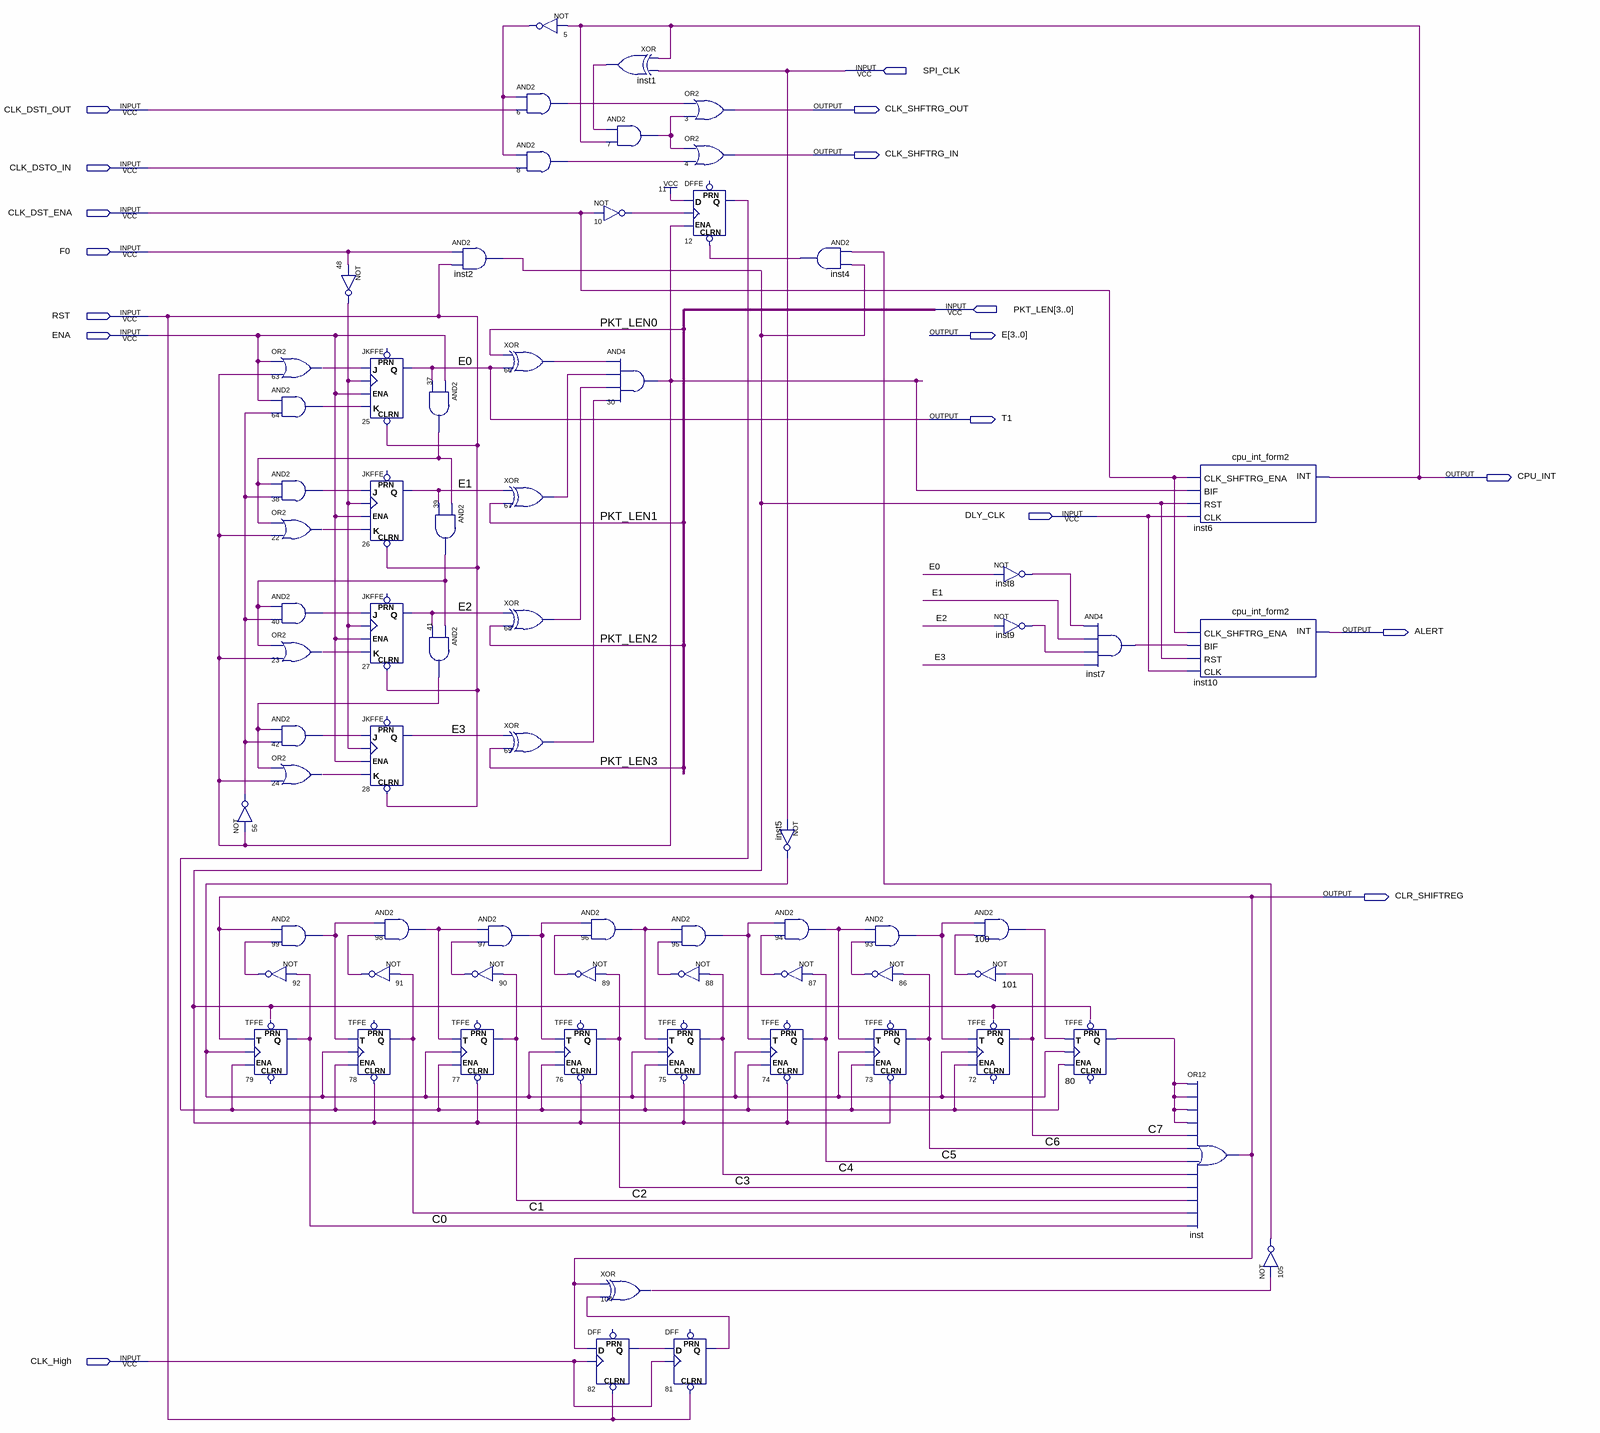
[diagram p0: schematic sheet]
// Quartus schematic stbus_ctrl2.bdf as structural Verilog: 69 symbols, 17 pins
module stbus_ctrl2 (
  input  SPI_CLK,
  input  CLK_DSTI_OUT,
  input  CLK_DSTO_IN,
  input  CLK_DST_ENA,
  input  F0,
  input  [3:0] PKT_LEN,
  input  RST,
  input  ENA,
  input  DLY_CLK,
  input  CLK_High,
  output CLK_SHFTRG_OUT,
  output CLK_SHFTRG_IN,
  output [3:0] E,
  output T1,
  output CPU_INT,
  output ALERT,
  output CLR_SHIFTREG
);

  wire C0, C1, C2, C3, C4, C5, C6, C7, inst1_out, inst2_out, inst4_out, inst5_out, inst7_out, inst8_out,
       inst9_out, n5_out, n6_out, n7_out, n8_out, n10_out, n12_q, n22_out, n23_out, n24_out, n30_out,
       n37_out, n38_out, n39_out, n40_out, n41_out, n42_out, n48_out, n56_out, n63_out, n64_out, n66_out,
       n67_out, n68_out, n69_out, n80_q, n81_q, n82_q, n86_out, n87_out, n88_out, n89_out, n90_out, n91_out,
       n92_out, n93_out, n94_out, n95_out, n96_out, n97_out, n98_out, n99_out, n100_out, n101_out, n104_out,
       n105_out;

  or u_63 (n63_out, ENA, n30_out);
  and u_64 (n64_out, ENA, n56_out);
  and u_38 (n38_out, n37_out, n56_out);
  or u_22 (n22_out, n37_out, n30_out);
  and u_40 (n40_out, n39_out, n56_out);
  or u_23 (n23_out, n39_out, n30_out);
  and u_42 (n42_out, n41_out, n56_out);
  or u_24 (n24_out, n41_out, n30_out);
  not u_56 (n56_out, n30_out);
  and u_99 (n99_out, CLR_SHIFTREG, n92_out);
  not u_92 (n92_out, C0);
  TFFE u_79 (.PRN(inst2_out), .T(CLR_SHIFTREG), .CLK(inst5_out), .ENA(n12_q), .Q(C0));  // open: CLRN
  not u_48 (n48_out, F0);
  JKFFE u_25 (.J(n63_out), .CLK(n48_out), .CLRN(RST), .K(n64_out), .ENA(ENA), .Q(E[0]));  // open: PRN
  JKFFE u_26 (.J(n38_out), .CLK(n48_out), .CLRN(RST), .K(n22_out), .ENA(ENA), .Q(E[1]));  // open: PRN
  JKFFE u_27 (.J(n40_out), .CLK(n48_out), .CLRN(RST), .K(n23_out), .ENA(ENA), .Q(E[2]));  // open: PRN
  JKFFE u_28 (.J(n42_out), .CLK(n48_out), .CLRN(RST), .K(n24_out), .ENA(ENA), .Q(E[3]));  // open: PRN
  and u_98 (n98_out, n99_out, n91_out);
  not u_91 (n91_out, C1);
  TFFE u_78 (.CLRN(inst2_out), .T(n99_out), .CLK(inst5_out), .ENA(n12_q), .Q(C1));  // open: PRN
  and u_37 (n37_out, ENA, E[0]);
  and u_39 (n39_out, n37_out, E[1]);
  and u_41 (n41_out, n39_out, E[2]);
  and inst2 (inst2_out, F0, RST);
  and u_97 (n97_out, n98_out, n90_out);
  not u_90 (n90_out, C2);
  TFFE u_77 (.CLRN(inst2_out), .T(n98_out), .CLK(inst5_out), .ENA(n12_q), .Q(C2));  // open: PRN
  not u_5 (n5_out, CPU_INT);
  and u_6 (n6_out, n5_out, CLK_DSTI_OUT);
  and u_8 (n8_out, n5_out, CLK_DSTO_IN);
  xor u_66 (n66_out, PKT_LEN[0], E[0]);
  xor u_67 (n67_out, E[1], PKT_LEN[1]);
  xor u_68 (n68_out, E[2], PKT_LEN[2]);
  xor u_69 (n69_out, E[3], PKT_LEN[3]);
  and u_96 (n96_out, n97_out, n89_out);
  not u_89 (n89_out, C3);
  TFFE u_76 (.CLRN(inst2_out), .T(n97_out), .CLK(inst5_out), .ENA(n12_q), .Q(C3));  // open: PRN
  DFF u_82 (.CLRN(RST), .CLK(CLK_High), .D(CLR_SHIFTREG), .Q(n82_q));  // open: PRN
  xor inst1 (inst1_out, CPU_INT, SPI_CLK);
  and u_7 (n7_out, inst1_out, CPU_INT);
  not u_10 (n10_out, CLK_DST_ENA);
  and u_30 (n30_out, n66_out, n67_out, n68_out, n69_out);
  xor u_104 (n104_out, CLR_SHIFTREG, n81_q);
  or u_3 (CLK_SHFTRG_OUT, n6_out, n7_out);
  or u_4 (CLK_SHFTRG_IN, n7_out, n8_out);
  DFFE u_12 (.CLRN(inst4_out), .D(1'b1), .CLK(n10_out), .ENA(n30_out), .Q(n12_q));  // open: PRN
  and u_95 (n95_out, n96_out, n88_out);
  not u_88 (n88_out, C4);
  TFFE u_75 (.CLRN(inst2_out), .T(n96_out), .CLK(inst5_out), .ENA(n12_q), .Q(C4));  // open: PRN
  DFF u_81 (.CLRN(RST), .CLK(CLK_High), .D(n82_q), .Q(n81_q));  // open: PRN
  not inst5 (inst5_out, SPI_CLK);
  and u_94 (n94_out, n95_out, n87_out);
  not u_87 (n87_out, C5);
  TFFE u_74 (.CLRN(inst2_out), .T(n95_out), .CLK(inst5_out), .ENA(n12_q), .Q(C5));  // open: PRN
  and inst4 (inst4_out, n105_out, inst2_out);
  and u_93 (n93_out, n94_out, n86_out);
  not u_86 (n86_out, C6);
  TFFE u_73 (.CLRN(inst2_out), .T(n94_out), .CLK(inst5_out), .ENA(n12_q), .Q(C6));  // open: PRN
  not inst8 (inst8_out, E[0]);
  not inst9 (inst9_out, E[2]);
  and u_100 (n100_out, n93_out, n101_out);
  not u_101 (n101_out, C7);
  TFFE u_72 (.PRN(inst2_out), .T(n93_out), .CLK(inst5_out), .ENA(n12_q), .Q(C7));  // open: CLRN
  and inst7 (inst7_out, inst8_out, E[1], inst9_out, E[3]);
  TFFE u_80 (.PRN(inst2_out), .T(n100_out), .CLK(inst5_out), .ENA(n12_q), .Q(n80_q));  // open: CLRN
  cpu_int_form2 inst6 (.CLK_SHFTRG_ENA(CLK_DST_ENA), .BIF(n30_out), .RST(inst2_out), .CLK(DLY_CLK), .INT(CPU_INT));
  cpu_int_form2 inst10 (.CLK_SHFTRG_ENA(CLK_DST_ENA), .BIF(inst7_out), .RST(inst2_out), .CLK(DLY_CLK), .INT(ALERT));
  or inst (CLR_SHIFTREG, n80_q, n80_q, n80_q, n80_q, C7, C6, C5, C4, C3, C2, C1, C0);
  not u_105 (n105_out, n104_out);

  assign T1 = E[0];
endmodule
